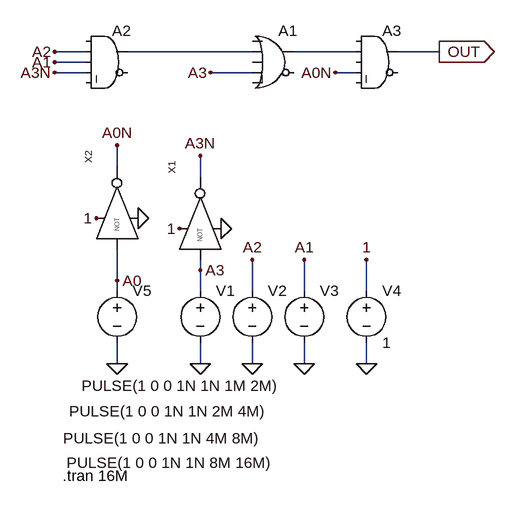
[diagram p0: schematic LAB_PRACTİCAL1.asc]
LAB_PRACTİCAL1.asc, the LTspice schematic file:
Version 4
SHEET 1 1244 684
WIRE 592 16 544 16
WIRE 848 16 656 16
WIRE 1008 16 912 16
WIRE 1136 16 1072 16
WIRE 592 32 544 32
WIRE 592 48 544 48
WIRE 848 48 784 48
WIRE 1008 48 976 48
WIRE 640 192 640 160
WIRE 768 208 768 176
WIRE 768 352 768 336
WIRE 640 368 640 320
WIRE 640 384 640 368
WIRE 768 384 768 352
WIRE 848 384 848 336
WIRE 928 384 928 336
WIRE 1024 384 1024 336
WIRE 640 496 640 464
WIRE 768 496 768 464
WIRE 848 496 848 464
WIRE 928 496 928 464
WIRE 1024 496 1024 464
FLAG 768 176 A3N
FLAG 848 336 A2
FLAG 928 336 A1
FLAG 736 288 1
FLAG 1024 336 1
FLAG 1024 496 0
FLAG 928 496 0
FLAG 848 496 0
FLAG 768 496 0
FLAG 800 288 0
FLAG 768 352 A3
FLAG 640 368 A0
FLAG 640 496 0
FLAG 784 48 A3
FLAG 544 16 A2
FLAG 544 32 A1
FLAG 544 48 A3N
FLAG 1136 16 OUT
IOPIN 1136 16 Out
FLAG 976 48 A0N
FLAG 640 160 A0N
FLAG 608 272 1
FLAG 672 272 0
SYMBOL voltage 768 368 R0
WINDOW 3 -206 280 Left 2
WINDOW 123 0 0 Left 0
WINDOW 39 0 0 Left 0
SYMATTR InstName V1
SYMATTR Value PULSE(1 0 0 1N 1N 8M 16M)
SYMBOL voltage 848 368 R0
WINDOW 3 -291 243 Left 2
WINDOW 123 0 0 Left 0
WINDOW 39 0 0 Left 0
SYMATTR InstName V2
SYMATTR Value PULSE(1 0 0 1N 1N 4M 8M)
SYMBOL voltage 928 368 R0
WINDOW 3 -362 201 Left 2
WINDOW 123 0 0 Left 0
WINDOW 39 0 0 Left 0
SYMATTR InstName V3
SYMATTR Value PULSE(1 0 0 1N 1N 2M 4M)
SYMBOL NOT4 784 272 R270
SYMATTR InstName X1
SYMBOL voltage 1024 368 R0
WINDOW 123 0 0 Left 0
WINDOW 39 0 0 Left 0
SYMATTR InstName V4
SYMATTR Value 1
SYMBOL voltage 640 368 R0
WINDOW 3 -55 162 Left 2
WINDOW 123 0 0 Left 0
WINDOW 39 0 0 Left 0
SYMATTR InstName V5
SYMATTR Value PULSE(1 0 0 1N 1N 1M 2M)
SYMBOL Digital\\or 880 -32 R0
SYMATTR InstName A1
SYMBOL Digital\\and 624 -32 R0
SYMATTR InstName A2
SYMBOL Digital\\and 1040 -32 R0
SYMATTR InstName A3
SYMBOL NOT4 656 256 R270
SYMATTR InstName X2
TEXT 556 668 Left 2 !.tran 16M

The netlist it stands for:
* LAB_PRACTİCAL1.asc
V1 A3 0 PULSE(1 0 0 1N 1N 8M 16M)
V2 A2 0 PULSE(1 0 0 1N 1N 4M 8M)
V3 A1 0 PULSE(1 0 0 1N 1N 2M 4M)
XX1 A3 1 0 A3N NOT4  ; pins A VH VL OUT
V4 1 0 1
V5 A0 0 PULSE(1 0 0 1N 1N 1M 2M)
A1 0 N001 0 A3 0 0 N002 0 OR
A2 0 A2 A1 A3N 0 0 N001 0 AND
A3 0 N002 0 A0N 0 0 OUT 0 AND
XX2 A0 1 0 A0N NOT4  ; pins A VH VL OUT
.tran 16M
.backanno
.end